# Altium schematic sheet Connectors.SchDoc
size A
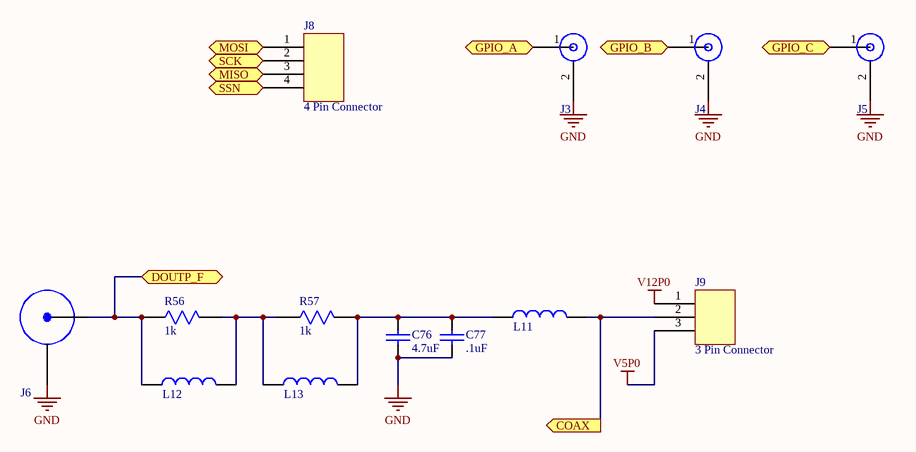
[diagram p0: Connectors.SchDoc]

## Parts
C76  4.7uF  [SMD Capacitor 0603]
C77  .1uF  [SMD CAP 0402]
J3  SMA  [SMA Right Angle Through Hole]  (value not drawn)
J4  SMA  [SMA Right Angle Through Hole]  (value not drawn)
J5  SMA  [SMA Right Angle Through Hole]  (value not drawn)
J6  Coax Connector  [SSMCX EDGE]  (value not drawn)
J8  4 Pin Connector  [4Pin Verital 0.1"]
J9  3 Pin Connector  [3Pin Verital 0.1" JUMOER]
L11  Ferrite Bead  [BLM18KG601SN1D]  (value not drawn)
L12  Ferrite Bead  [CIG21L4R7MNE]  (value not drawn)
L13  Ferrite Bead  [CBC3225T101MR]  (value not drawn)
R56  1k  [SMD Resistor 0603]
R57  1k  [SMD Resistor 0603]

## Ports
COAX (out), DOUTP_F (bidir), GPIO_A (bidir), GPIO_B (bidir), GPIO_C (bidir), MISO (out), MOSI (in), SCK (in), SSN (in)

## Nets
GND: C76.1 C77.1 J3.2 J4.2 J5.2 J6.1
V5P0: J9.3
V12P0: J9.1
COAX: J9.2 L11.2 ; port COAX
DOUTP_F: J6.0 L12.1 R56.0 ; port DOUTP_F
GPIO_A: J3.1 ; port GPIO_A
GPIO_B: J4.1 ; port GPIO_B
GPIO_C: J5.1 ; port GPIO_C
MISO: J8.3 ; port MISO
MOSI: J8.1 ; port MOSI
SCK: J8.2 ; port SCK
SSN: J8.4 ; port SSN
NetC76_0: C76.0 C77.0 L11.1 L13.2 R57.1
NetL12_2: L12.2 L13.1 R56.1 R57.0

## Library data of the parts
C76 C77 = Capacitor: Value: C?
R56 R57 = Resistor: Value: ?